# EasyEDA schematic SCH_1D-Pong Led strip 2_2023-03-20.json
TITLE: Sheet_1; REV: 1.0; Date: 2023-03-09; Sheet: 1/1; Drawn By: fossez; Company: Your Company
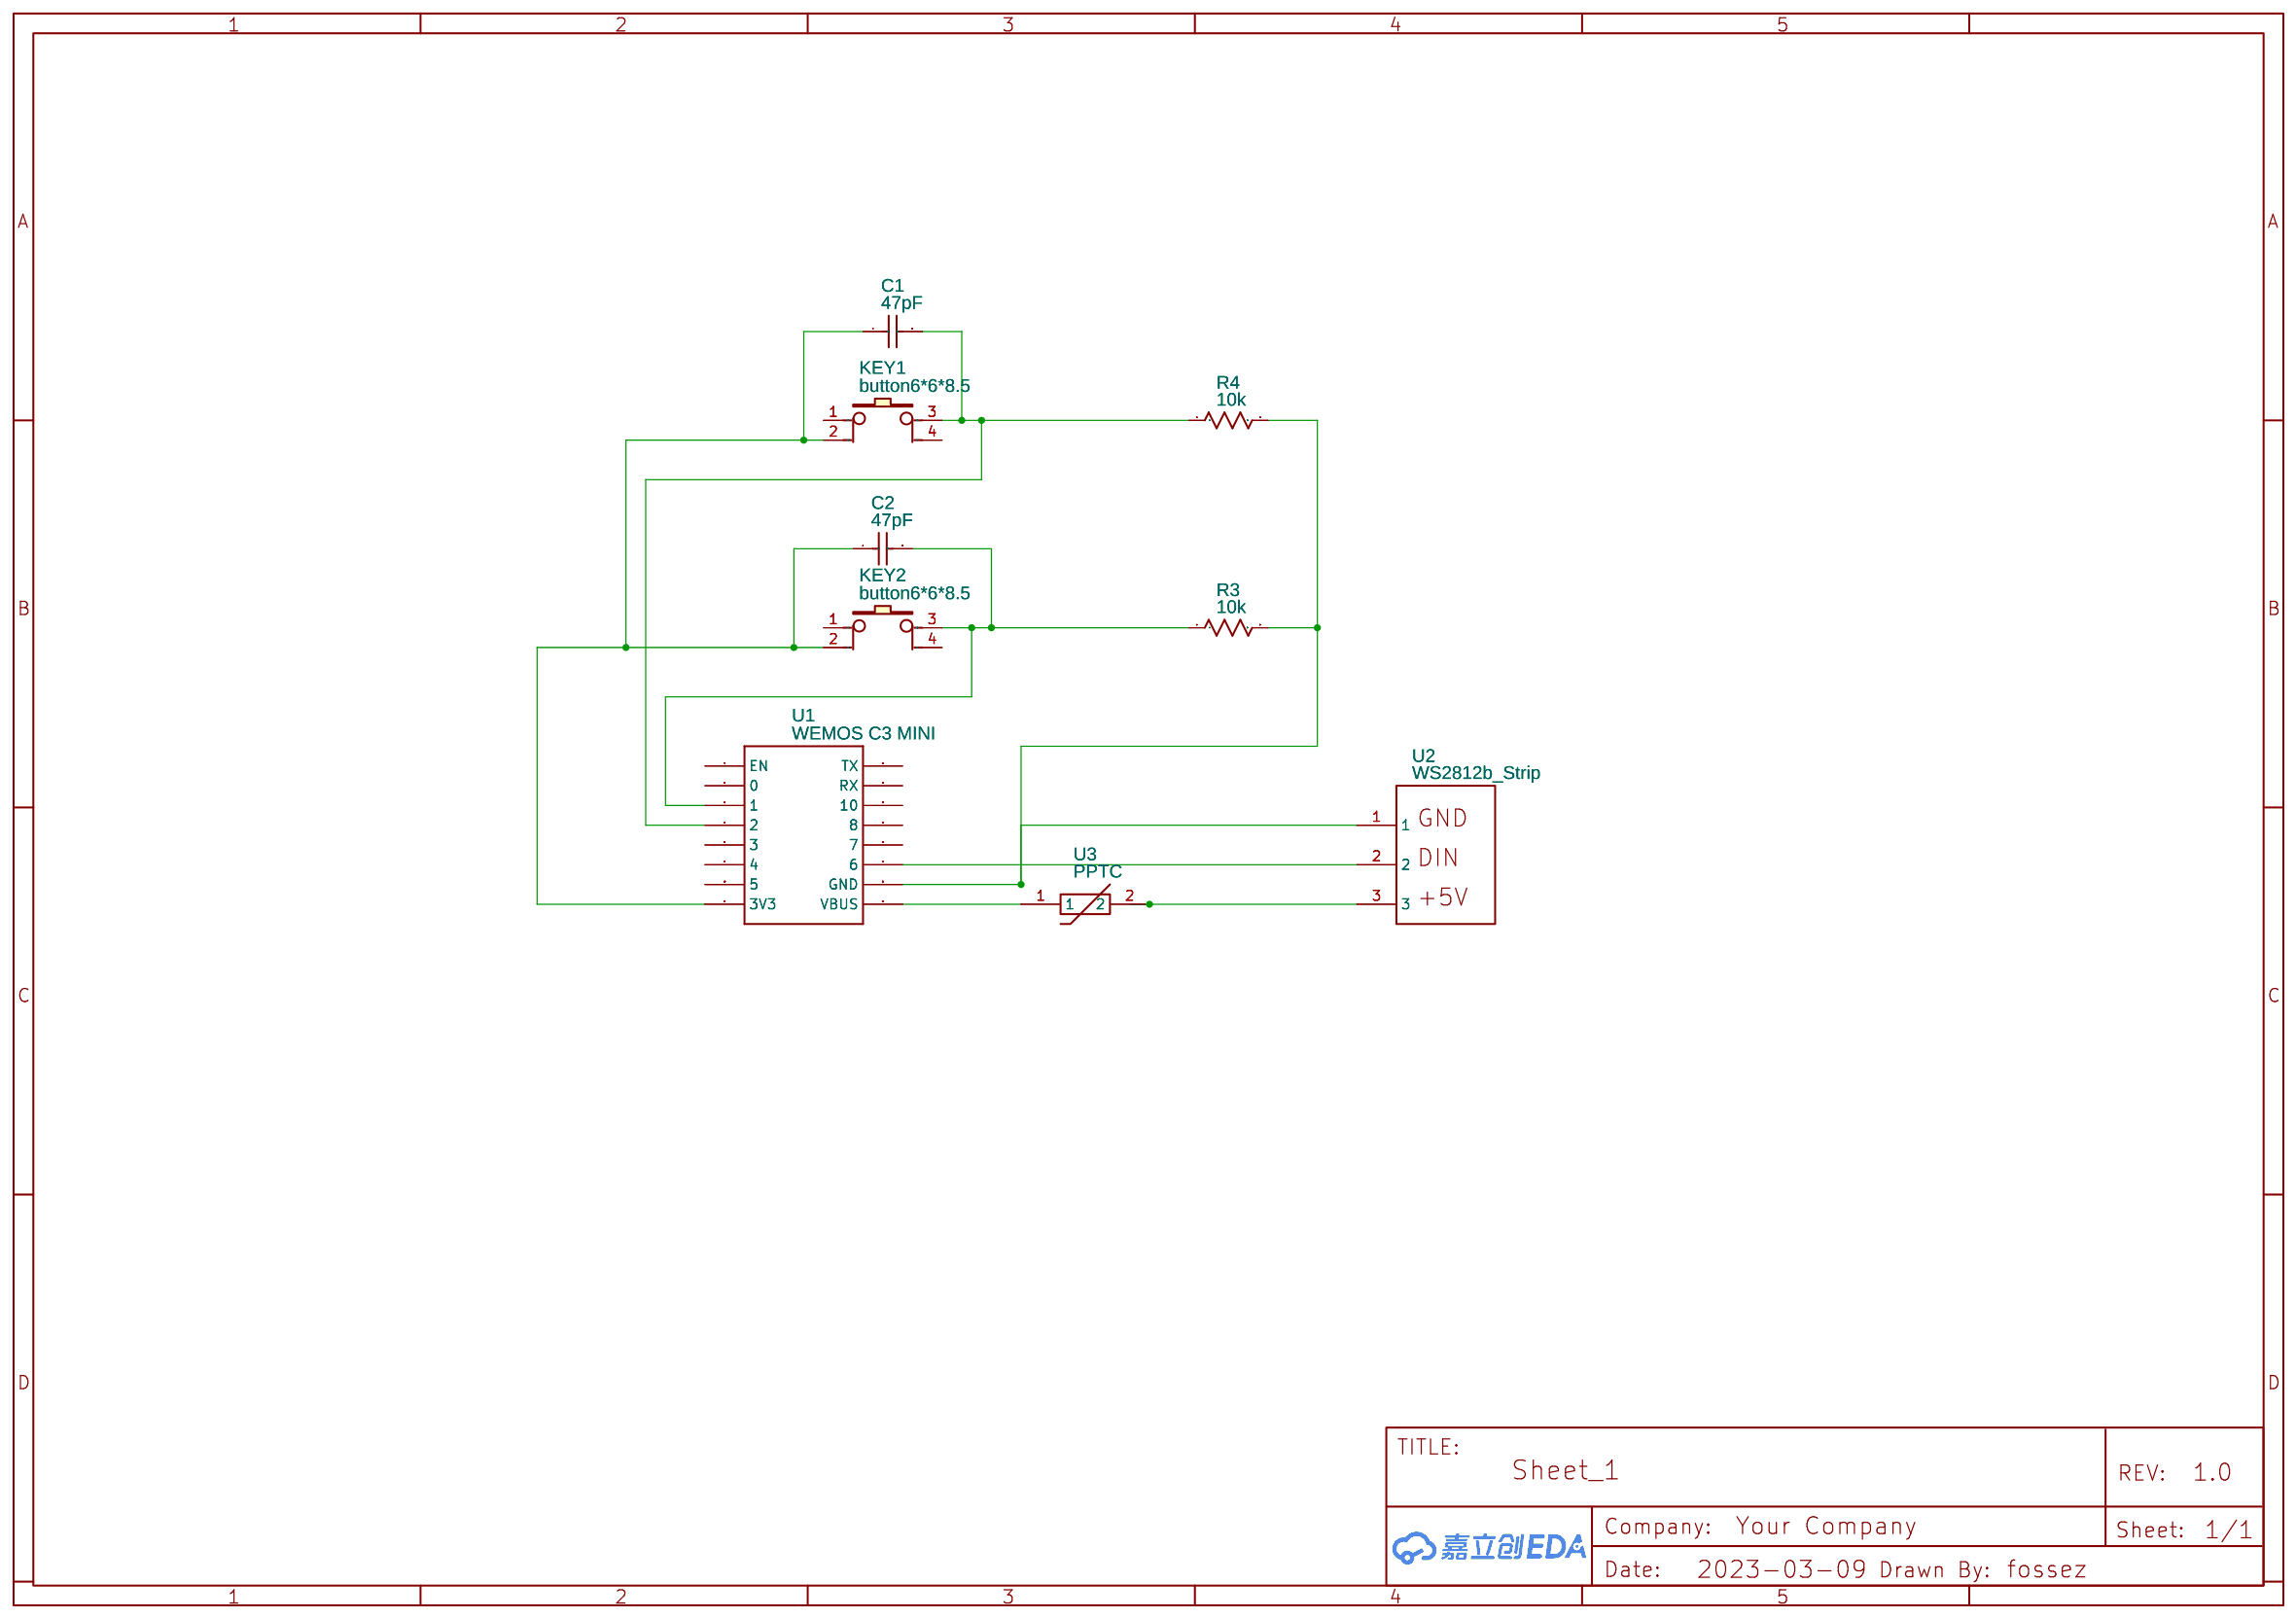
[diagram p0: schematic sheet]

## Parts
C1  47pF  [CAP-TH_L5.0-W4.0-P5.00-D1.0]
C2  47pF  [CAP-TH_L5.0-W4.0-P5.00-D1.0]
KEY1  button6*6*8.5  [KEY-TH_4P-L6.0-W6.0-P4.50]
KEY2  button6*6*8.5  [KEY-TH_4P-L6.0-W6.0-P4.50]
R3  10k  [PKG-0.25W RESISTOR]
R4  10k  [PKG-0.25W RESISTOR]
U1  WEMOS C3 MINI  [WEMOS D1]
U2  WS2812b_Strip  [WS2812B_STRIP]
U3  PPTC  [PPTC]

## Library data of the parts
C1 C2 = Ceramic capacitors47PF 3KV: Supplier: LCSC; Manufacturer: ReliaPro; Supplier Part: C19375; JLCPCB Part Class: Extended Part
KEY1 KEY2 = button6*6*8.5: Supplier Part: C59980; Supplier: LCSC; Manufacturer: ReliaPro
R3 R4 = MCF 0.25W 10K: Power: 1/4W; Tolerance: ±5%; Supplier Part: 9339116; Supplier: Element14; Manufacturer: MULTICOMP; link: http://www.farnell.com/datasheets/1716725.pdf?_ga=2.130313612.2023696496.1506695686-238689616.1505921947&_gac=1.45287312.1506011718.EAIaIQobChMI57GX6tq21gIVTzobCh2WXgT2EAAYASAAEgKn9_D_BwE; Contributor: Prof. Ing. F. Scordino
U1 = WEMOS C3 MINI: sourceId: YemgaslDx; Contributor: Hanimaniac86
U2 = WS2812b_Strip: Contributor: thomasardik
U3 = PPTC: Contributor: DEVAZ

## Nets
Net-(C1-1): C1.1 C2.1 KEY1.2 KEY2.2 U1.5V(3V3)
Net-(C1-2): C1.2 KEY1.3 R4.1 U1.D2(2)
Net-(C2-2): C2.2 KEY2.3 R3.1 U1.D1(1)
Net-(R3-2): R3.2 R4.2 U1.D8(GND) U2.1
Net-(U1-3V3): U1.3V3(VBUS) U3.1
Net-(U1-D7): U1.D7(6) U2.2
Net-(U2-3): U2.3 U3.2

Not connected (* = marked no-connect by the designer): KEY1 1 4; KEY2 1 4; U1 A0(RX) D0(10) D3(3) D4(4) D5(8) D6(7) GND(5) RST(TX) RX(0) TX(EN)
